# EAGLE design AquaLed-logic (EAGLE 8.4.1)
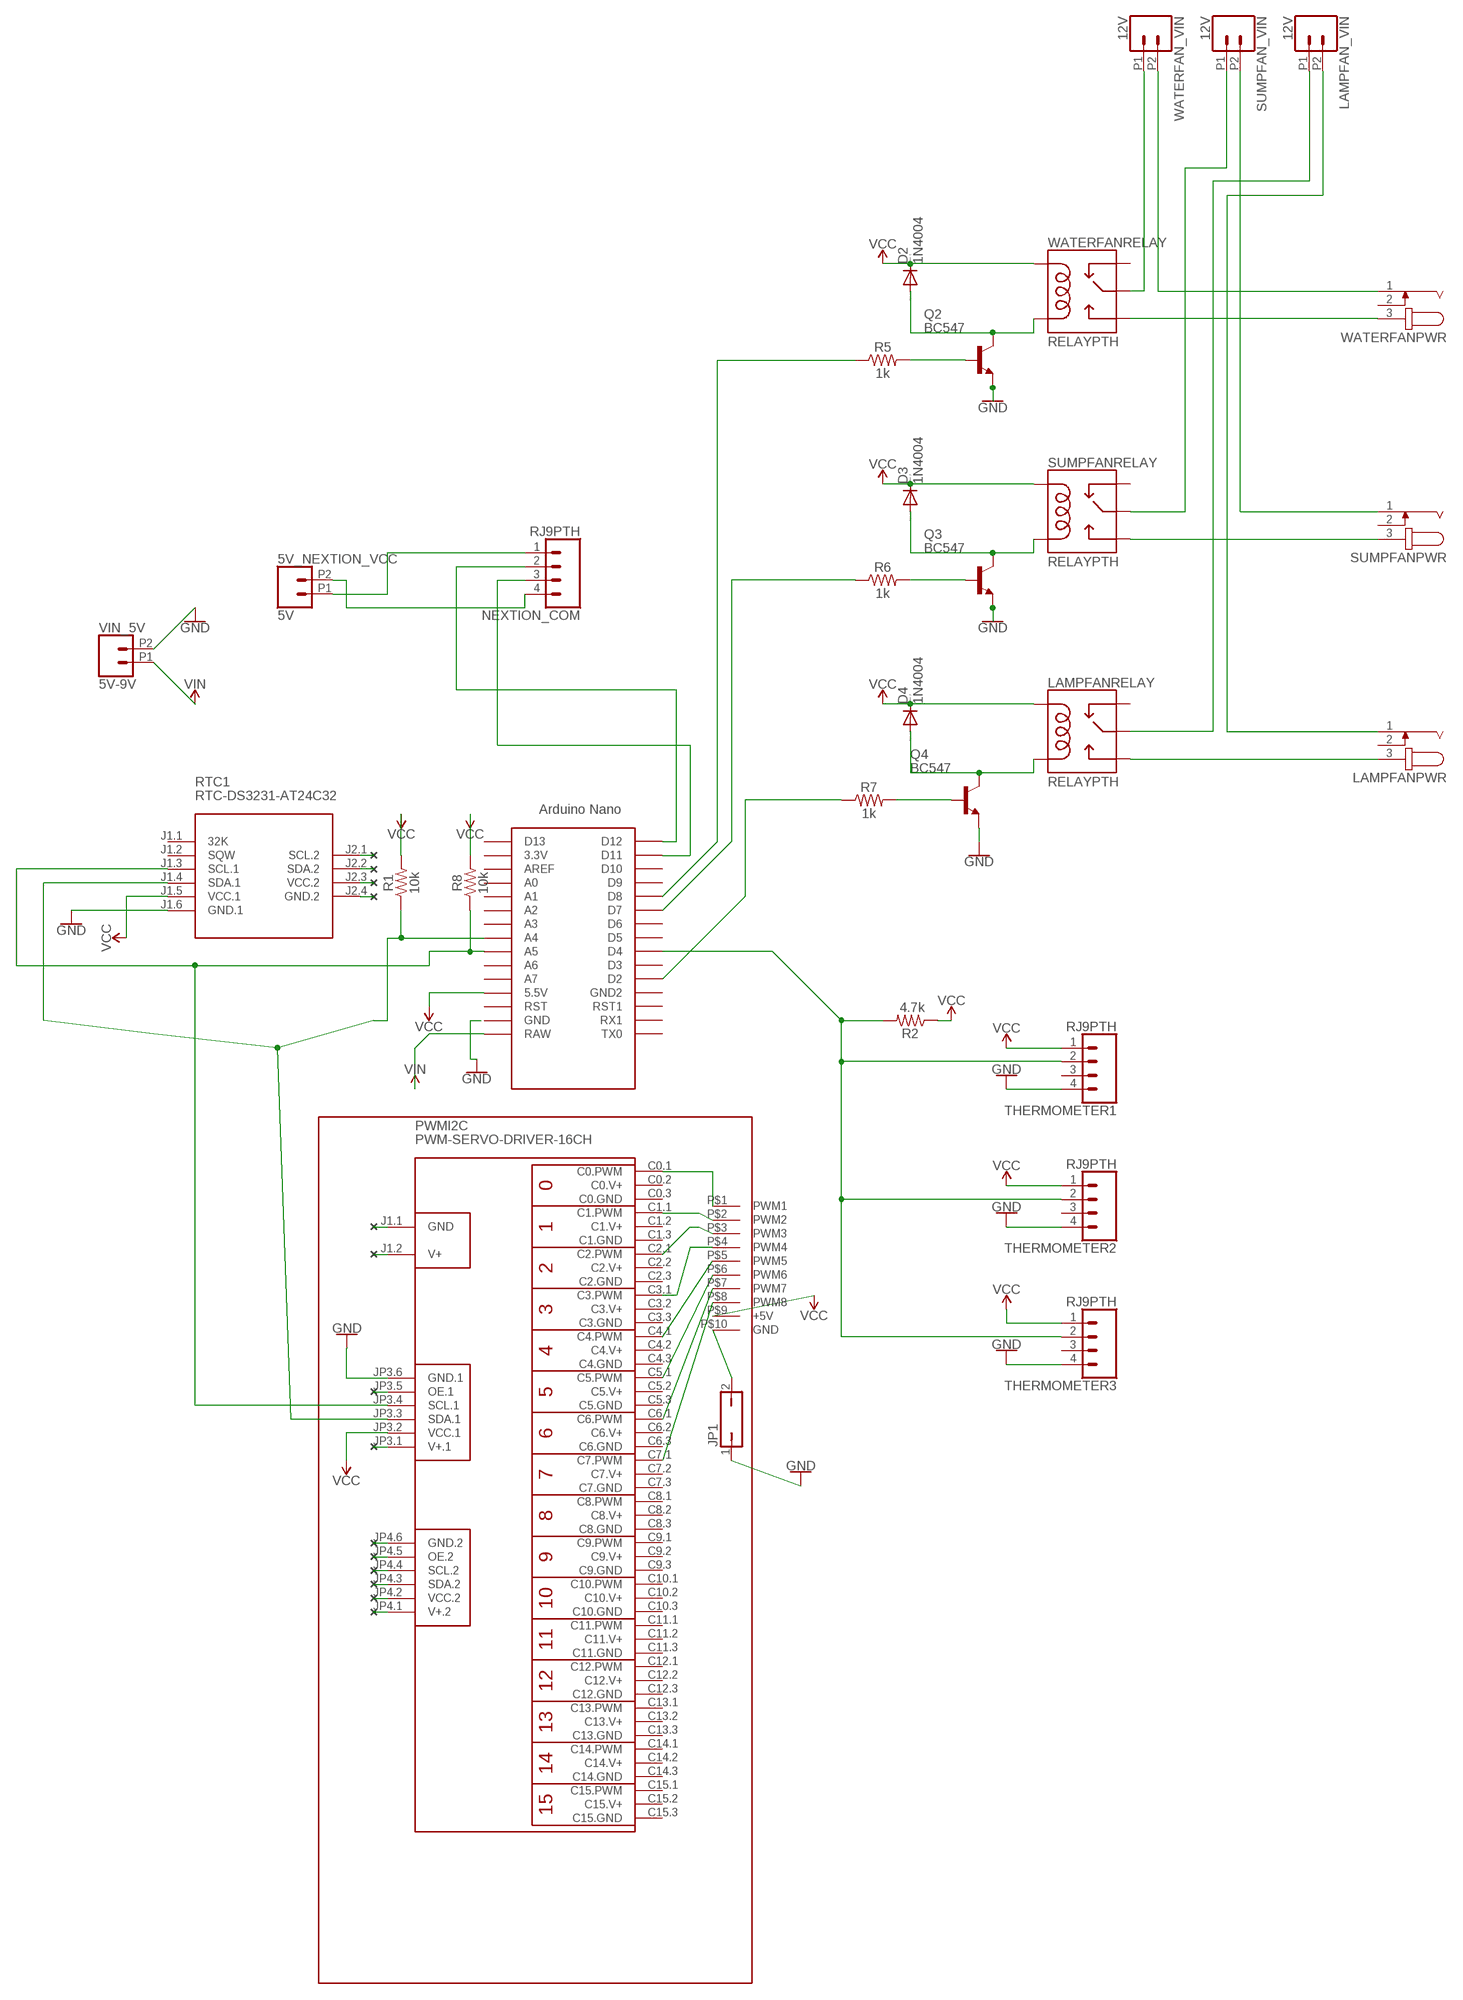
[diagram p0: schematic, sheet 1]

## Parts
5V_NEXTION_VCC  5V  CONN_022.54MM_SCREWTERM  [1X02_2.54_SCREWTERM]
D2  1N4004  [DO41-10]
D3  1N4004  [DO41-10]
D4  1N4004  [DO41-10]
JP1  JP1Q  [JP1]
LAMPFAN_VIN  12V  CONN_022.54MM_SCREWTERM  [1X02_2.54_SCREWTERM]
LAMPFANPWR  JACK-PLUG1  [SPC4078]
LAMPFANRELAY  RELAYPTH  [SRD-05VDC-SL-C]
NEXTION_COM  RJ9PTH  [RJ9]
PWMI2C  PWM-SERVO-DRIVER-16CH  [PWM-SERVO-DRIVER-16CH]
Q2  BC547  [TO92]
Q3  BC547  [TO92]
Q4  BC547  [TO92]
R1  10k  10KOHM-HORIZ-1/6W-5%  [AXIAL-0.3]
R2  4.7k  RESISTORAXIAL-0.3  [AXIAL-0.3]
R5  1k  10KOHM-HORIZ-1/4W-1%  [AXIAL-0.3]
R6  1k  10KOHM-HORIZ-1/4W-1%  [AXIAL-0.3]
R7  1k  10KOHM-HORIZ-1/4W-1%  [AXIAL-0.3]
R8  10k  10KOHM-HORIZ-1/6W-5%  [AXIAL-0.3]
RTC1  RTC-DS3231-AT24C32  [RTC-DS3231-AT24C32]
SUMPFAN_VIN  12V  CONN_022.54MM_SCREWTERM  [1X02_2.54_SCREWTERM]
SUMPFANPWR  JACK-PLUG1  [SPC4078]
SUMPFANRELAY  RELAYPTH  [SRD-05VDC-SL-C]
THERMOMETER1  RJ9PTH  [RJ9]
THERMOMETER2  RJ9PTH  [RJ9]
THERMOMETER3  RJ9PTH  [RJ9]
U$1  NANO  [NANO]
U$29  PCB  [PCB]
VIN_5V  5V-9V  CONN_022.54MM_SCREWTERM  [1X02_2.54_SCREWTERM]
WATERFAN_VIN  12V  CONN_022.54MM_SCREWTERM  [1X02_2.54_SCREWTERM]
WATERFANPWR  JACK-PLUG1  [SPC4078]
WATERFANRELAY  RELAYPTH  [SRD-05VDC-SL-C]

## Nets
GND [power]: JP1.1 PWMI2C.JP3.6(GND.1) Q2.1(E) Q3.1(E) Q4.1(E) RTC1.J1.6(GND.1) THERMOMETER1.4 THERMOMETER2.4 THERMOMETER3.4 U$1.GND VIN_5V.P2
N$1: R2.P$2 THERMOMETER1.2 THERMOMETER2.2 THERMOMETER3.2 U$1.D4
N$2: RTC1.J2.4(GND.2)
N$3: PWMI2C.JP3.3(SDA.1) R1.P$1 RTC1.J1.4(SDA.1) U$1.A4
N$4: R5.P$1 U$1.D8
N$5: R6.P$1 U$1.D7
N$6 [powerpwm]: LAMPFANPWR.3 LAMPFANRELAY.SWOPEN
N$7 [powerpwm]: SUMPFANPWR.3 SUMPFANRELAY.SWOPEN
N$8 [powerpwm]: LAMPFAN_VIN.P1 LAMPFANRELAY.SWCOMMON
N$9: R7.P$1 U$1.D2
N$10: D2.A Q2.3(C) WATERFANRELAY.COIL0
N$11: Q2.2(B) R5.P$2
N$12 [powerpwm]: SUMPFAN_VIN.P2 SUMPFANPWR.1
N$13: D3.A Q3.3(C) SUMPFANRELAY.COIL0
N$14: Q3.2(B) R6.P$2
N$15 [powerpwm]: LAMPFAN_VIN.P2 LAMPFANPWR.1
N$16: D4.A LAMPFANRELAY.COIL0 Q4.3(C)
N$17: Q4.2(B) R7.P$2
N$18 [powerpwm]: SUMPFAN_VIN.P1 SUMPFANRELAY.SWCOMMON
N$19 [powerpwm]: WATERFAN_VIN.P1 WATERFANRELAY.SWCOMMON
N$20 [powerpwm]: WATERFAN_VIN.P2 WATERFANPWR.1
N$21 [powerpwm]: WATERFANPWR.3 WATERFANRELAY.SWOPEN
N$22: 5V_NEXTION_VCC.P1 NEXTION_COM.1
N$23: 5V_NEXTION_VCC.P2 NEXTION_COM.4
N$24: NEXTION_COM.3 U$1.D11
N$25: NEXTION_COM.2 U$1.D12
N$26 [power]: PWMI2C.JP3.4(SCL.1) R8.P$1 RTC1.J1.3(SCL.1) U$1.A5
N$27: RTC1.J2.3(VCC.2)
N$28: PWMI2C.C0.1(C0.PWM) U$29.P$1(PWM1)
N$29: PWMI2C.C1.1(C1.PWM) U$29.P$2(PWM2)
N$30: PWMI2C.C2.1(C2.PWM) U$29.P$3(PWM3)
N$31: PWMI2C.C3.1(C3.PWM) U$29.P$4(PWM4)
N$32: PWMI2C.C4.1(C4.PWM) U$29.P$5(PWM5)
N$33: PWMI2C.C5.1(C5.PWM) U$29.P$6(PWM6)
N$34: PWMI2C.C6.1(C6.PWM) U$29.P$7(PWM7)
N$35: PWMI2C.C7.1(C7.PWM) U$29.P$8(PWM8)
N$36: JP1.2 U$29.P$10(GND)
N$54: RTC1.J2.2(SDA.2)
N$55: RTC1.J2.1(SCL.2)
N$56: PWMI2C.JP4.6(GND.2)
N$57: PWMI2C.JP4.5(OE.2)
N$58: PWMI2C.JP4.4(SCL.2)
N$59: PWMI2C.JP4.3(SDA.2)
N$60: PWMI2C.JP4.2(VCC.2)
N$61: PWMI2C.JP4.1(V+.2)
N$62: PWMI2C.JP3.1(V+.1)
N$63: PWMI2C.JP3.5(OE.1)
N$64: PWMI2C.J1.1(GND)
N$65: PWMI2C.J1.2(V+)
VCC [power]: D2.C D3.C D4.C LAMPFANRELAY.COIL1 PWMI2C.JP3.2(VCC.1) R1.P$2 R2.P$1 R8.P$2 RTC1.J1.5(VCC.1) SUMPFANRELAY.COIL1 THERMOMETER1.1 THERMOMETER2.1 THERMOMETER3.1 U$1.5V(5.5V) U$29.P$9(+5V) WATERFANRELAY.COIL1
VIN [power]: U$1.RAW VIN_5V.P1
Unconnected: LAMPFANPWR.2 LAMPFANRELAY.SWCLOSED(SWCLOSE) PWMI2C.C0.2(C0.V+) PWMI2C.C0.3(C0.GND) PWMI2C.C1.2(C1.V+) PWMI2C.C1.3(C1.GND) PWMI2C.C2.2(C2.V+) PWMI2C.C2.3(C2.GND) PWMI2C.C3.2(C3.V+) PWMI2C.C3.3(C3.GND) PWMI2C.C4.2(C4.V+) PWMI2C.C4.3(C4.GND) PWMI2C.C5.2(C5.V+) PWMI2C.C5.3(C5.GND) PWMI2C.C6.2(C6.V+) PWMI2C.C6.3(C6.GND) PWMI2C.C7.2(C7.V+) PWMI2C.C7.3(C7.GND) PWMI2C.C8.1(C8.PWM) PWMI2C.C8.2(C8.V+) PWMI2C.C8.3(C8.GND) PWMI2C.C9.1(C9.PWM) PWMI2C.C9.2(C9.V+) PWMI2C.C9.3(C9.GND) PWMI2C.C10.1(C10.PWM) PWMI2C.C10.2(C10.V+) PWMI2C.C10.3(C10.GND) PWMI2C.C11.1(C11.PWM) PWMI2C.C11.2(C11.V+) PWMI2C.C11.3(C11.GND) PWMI2C.C12.1(C12.PWM) PWMI2C.C12.2(C12.V+) PWMI2C.C12.3(C12.GND) PWMI2C.C13.1(C13.PWM) PWMI2C.C13.2(C13.V+) PWMI2C.C13.3(C13.GND) PWMI2C.C14.1(C14.PWM) PWMI2C.C14.2(C14.V+) PWMI2C.C14.3(C14.GND) PWMI2C.C15.1(C15.PWM) PWMI2C.C15.2(C15.V+) PWMI2C.C15.3(C15.GND) RTC1.J1.1(32K) RTC1.J1.2(SQW) SUMPFANPWR.2 SUMPFANRELAY.SWCLOSED(SWCLOSE) THERMOMETER1.3 THERMOMETER2.3 THERMOMETER3.3 U$1.3.3V U$1.A0 U$1.A1 U$1.A2 U$1.A3 U$1.A6 U$1.A7 U$1.AREF U$1.D3 U$1.D5 U$1.D6 U$1.D9 U$1.D10 U$1.D13 U$1.GND1(GND2) U$1.ICSP1 U$1.ICSP2 U$1.ICSP3 U$1.ICSP4 U$1.ICSP5 U$1.ICSP6 U$1.RST U$1.RST1 U$1.RX1 U$1.TX0 WATERFANPWR.2 WATERFANRELAY.SWCLOSED(SWCLOSE)

## Library data of the parts
5V_NEXTION_VCC LAMPFAN_VIN SUMPFAN_VIN VIN_5V WATERFAN_VIN = SparkFun-Connectors:CONN_02: Multi connection point. Often used as Generic Header-pin footprint for 0.1 inch spaced/style header connections On any of the 0.1 inch spaced packages, you can populate with these: Break Away Headers - Straight <https://www.sparkfun.com/products/116> (PRT-00116) Break Away Male Headers - Right Angle <https://www.sparkfun.com/products/553> (PRT-00553) Female Headers <https://www.sparkfun.com/products/115> (PRT-00115) Break Away Headers - Machine Pin <https://www.sparkfun.com/products/117> (PRT-00117) Break Away Female Headers - Swiss Machine Pin <https://www.sparkfun.com/products/743> (PRT-00743) For SCREWTERMINALS and SPRING TERMINALS visit here: Screw Terimnals on SparkFun.com <https://www.sparkfun.com/search/results?term=Screw+Terminals> (5mm/3.5mm/2.54mm spacing) This device is also useful as a general connection point to wire up your design to another part of your project. Our various solder wires solder well into these plated through hole pads. Hook-Up Wire - Assortment (Stranded, 22 AWG) <https://www.sparkfun.com/products/11375> (PRT-11375) Hook-Up Wire - Assortment (Solid Core, 22 AWG) <https://www.sparkfun.com/products/11367> (PRT-11367) View the entire wire category on our website here <https://www.sparkfun.com/categories/141> Special notes: Molex polarized connector foot print use with: PRT-08233 with associated crimp pins and housings. 2.54_SCREWTERM for use with PRT-10571. 3.5mm Screw Terminal footprints for PRT-08084 5mm Screw Terminal footprints for use with PRT-08432
D2-D4 = diode:1N4004: DIODE general purpose rectifier, 1 A
JP1 = jumper:JP1Q: JUMPER
LAMPFANPWR SUMPFANPWR WATERFANPWR = con-jack:JACK-PLUG: DC POWER JACK Power Jack, DC, Right Angle, Through Hole, Rated 5A at 16VDC, PC Terminals Distributor: Farnell (www.Farnell.de) Drawing: 84N1161.pdf / 84N1162.pdf Manufacturer: SPC Technology (www.spctechnology.com) Type: SPC4077 / SPC 4078
LAMPFANRELAY SUMPFANRELAY WATERFANRELAY = SRD-05VDC-SL-C:RELAY: SPDT relay (COM-00101)
NEXTION_COM THERMOMETER1-THERMOMETER3 = SparkFun-Retired:RJ9: This is a 4-pin connector commonly found on phone handsets. Great for simple TX/RX/PWR/GND connections. Sometime referred to as RJ9 or 4P4C. SparkFun does not currently use this on any active designs, and the connector alone has been retired. However, for more info visit here: https://www.sparkfun.com/products/retired/8694
PWMI2C = diy-modules:PWM-SERVO-DRIVER-16CH: 16-Channel 12-bit PWM/Servo Driver based on PCA9685 chip PCA9685 datasheet is available here: http://www.nxp.com/documents/data_sheet/PCA9685.pdf Arduino Library for PCA9685 is available here: https://github.com/kasperskaarhoj/PCA9685-Arduino-Library Click here to find device on ebay.com <http://www.ebay.com/sch/pwm+servo+module+pca9685>
Q2-Q4 = transistor-npn:BC547*: NPN Transistor
R1 R8 = SparkFun-Resistors:10KOHM: 10kΩ resistor A resistor is a passive two-terminal electrical component that implements electrical resistance as a circuit element. Resistors act to reduce current flow, and, at the same time, act to lower voltage levels within circuits. - Wikipedia; PROD_ID: RES-08375
R2 = SparkFun-Resistors:RESISTOR: Generic Resistor Package
R5-R7 = SparkFun-Resistors:10KOHM: 10kΩ resistor A resistor is a passive two-terminal electrical component that implements electrical resistance as a circuit element. Resistors act to reduce current flow, and, at the same time, act to lower voltage levels within circuits. - Wikipedia; PROD_ID: RES-12183; VALUE: 10k
RTC1 = diy-modules:RTC-DS3231-AT24C32: RTC Module with Battery and EEPROM based on DS3231 and AT24C32 chips Tutorial can be found here: https://edwardmallon.wordpress.com/2014/05/21/using-a-cheap-3-ds3231-rtc-at24c32-eeprom-from-ebay/ Click here to find device on ebay.com <http://www.ebay.com/sch/DS3231+AT24C32+module>; SPICEPREFIX: X
U$1 = Arduino-clone:NANO: Arduino Nano
U$29 = aqualed:PCB

## Net classes
0 default: width 0.406 mm
1 powerin: width 2 mm, clearance 0.6 mm
2 powerpwm: width 0.635 mm, clearance 0.5 mm
3 power: width 0.5 mm, clearance 0.2 mm

## Board
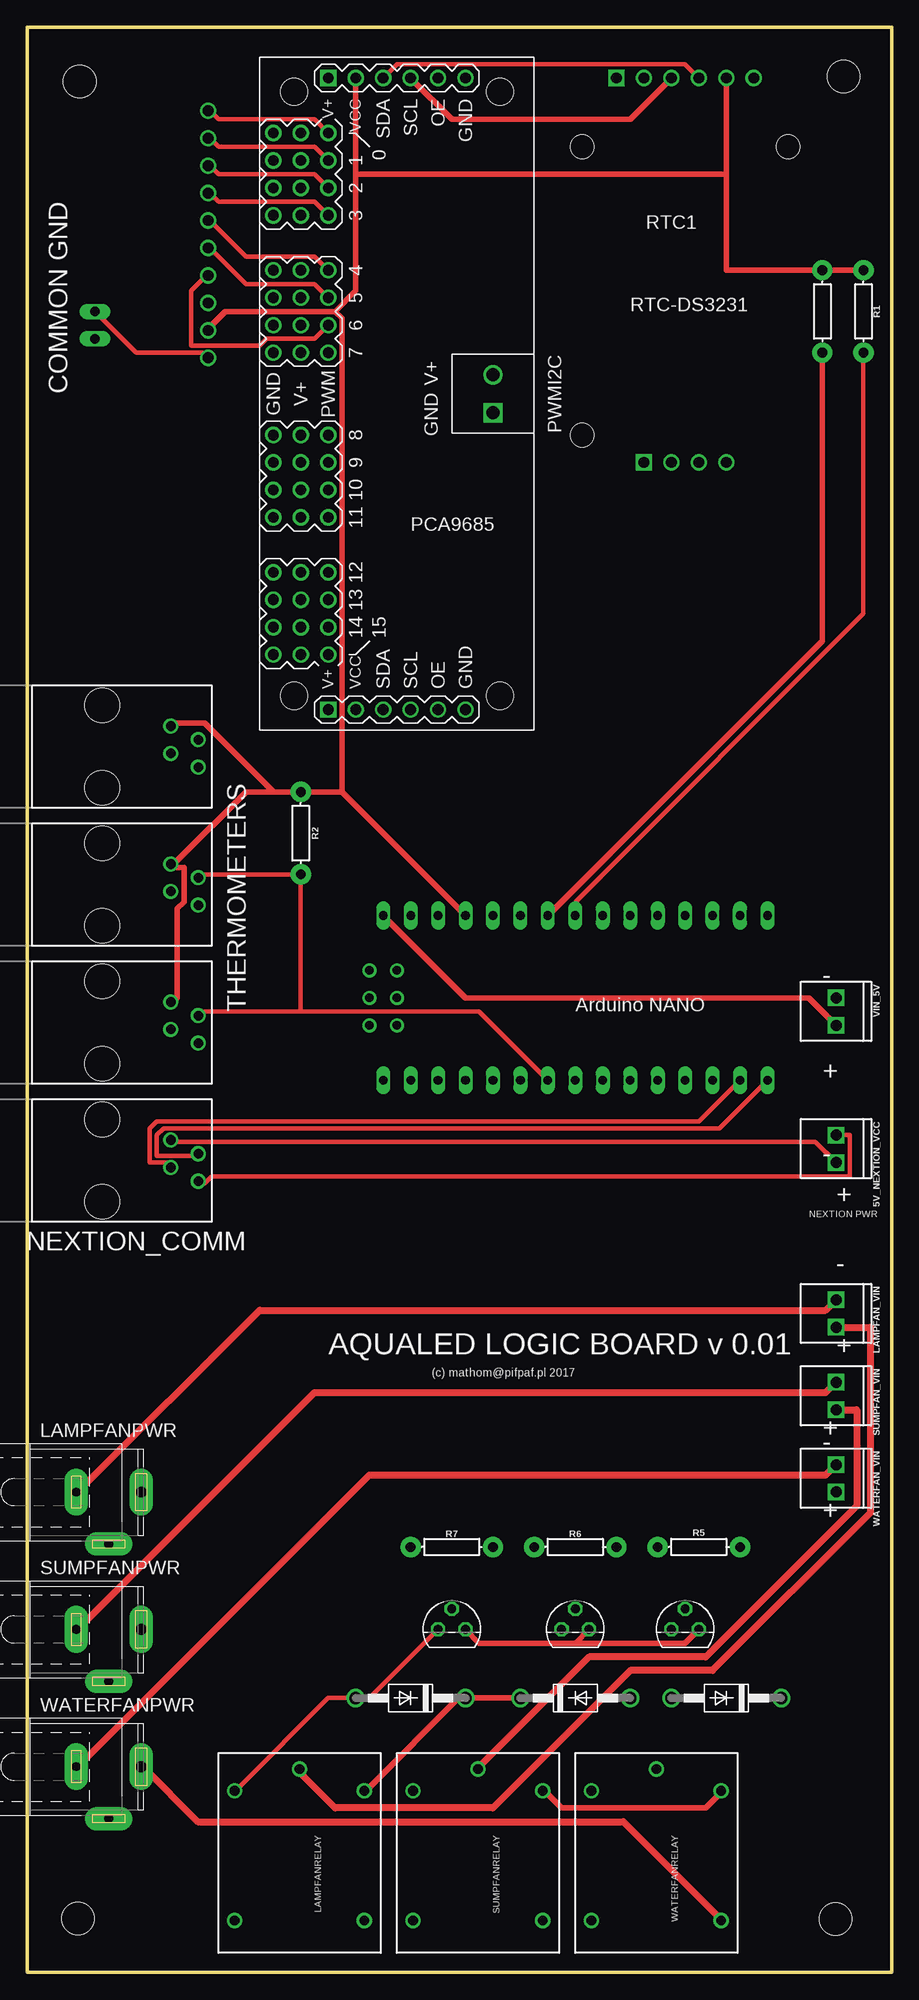
[diagram p1: board, top side]
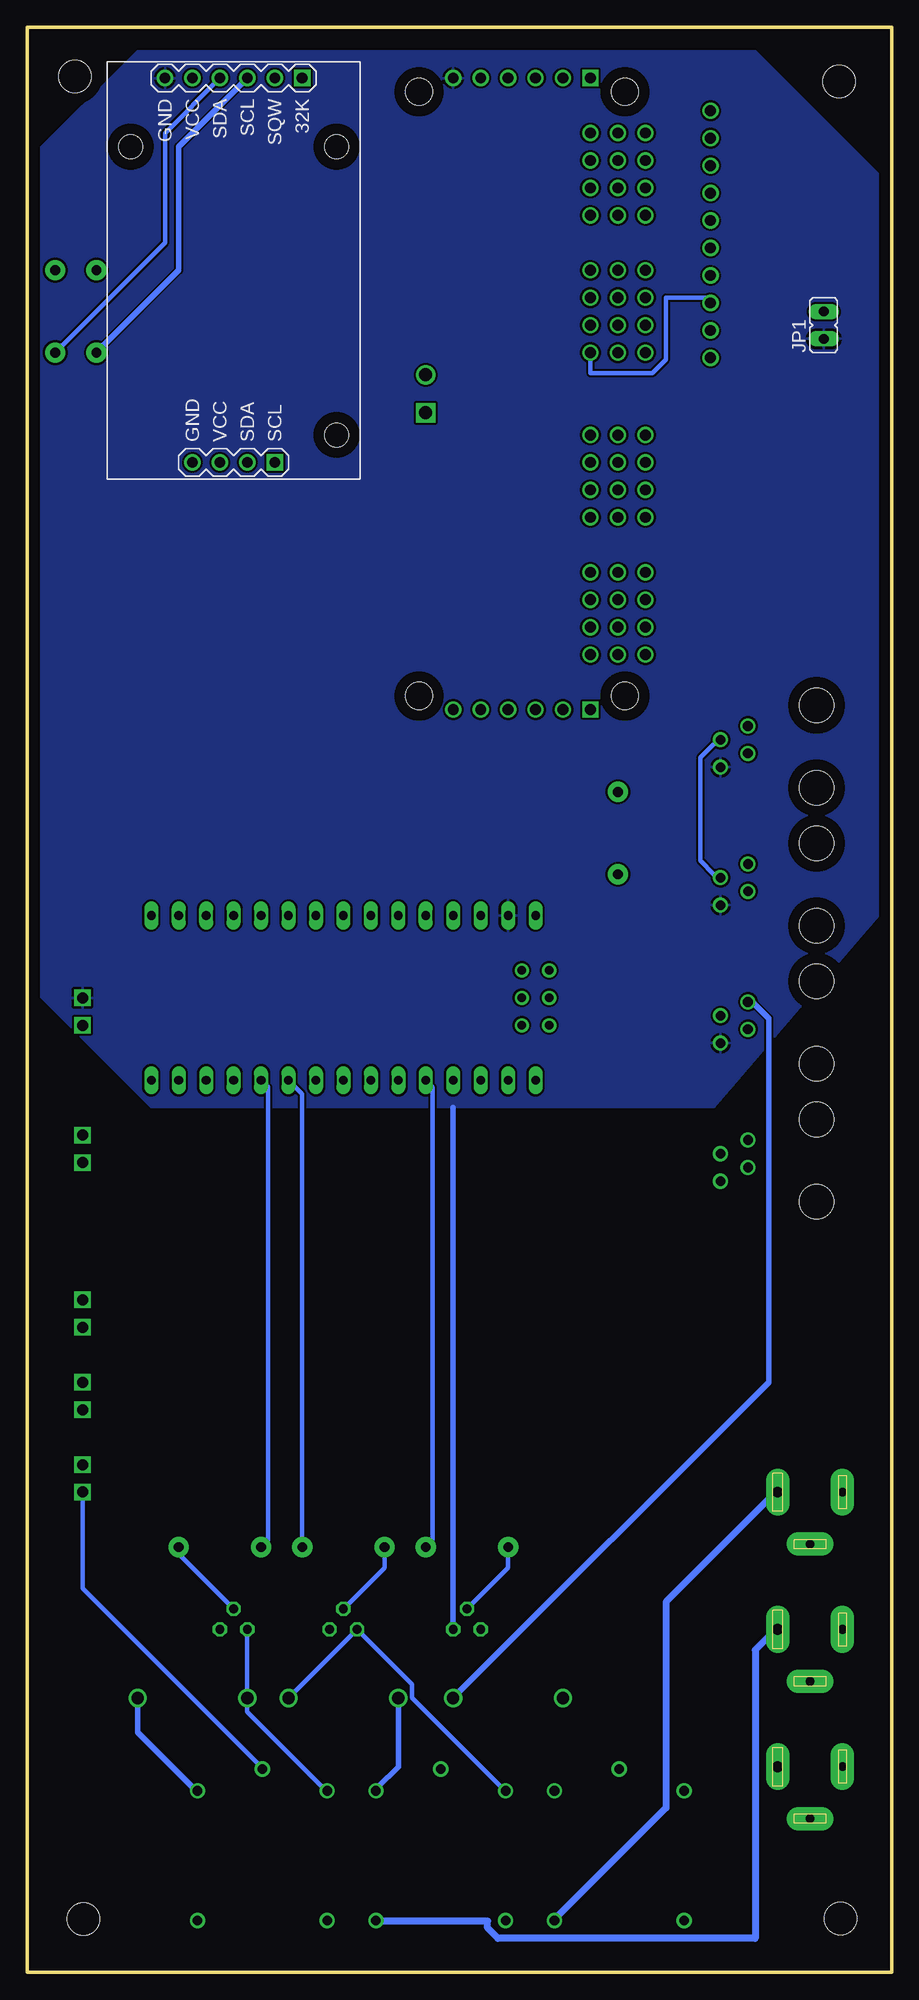
[diagram p2: board, bottom side, seen from below]

Size 80.01 x 179.97 mm. Coordinates in mm from the lower left corner, seen from the top.
Outline: 0,179.97 80.01,179.97 80.01,0 0,0 0,179.97
Copper layers (1*16): Top 0.035mm / dielectric 1.5mm / Bottom 0.035mm
Design rules "default": minimum track width 6mil, minimum drill 0.35mm, track to track 6mil, track to pad 6mil, pad to pad 6mil, via to via 6mil, smd to smd 6mil, copper to edge 40mil, drill to drill 6mil, minimum pad ring 10mil, minimum via ring 8mil, stop-mask expansion 4mil, vias tented up to drill 0mil, thermal gap 10mil

### Footprints (pad centres in the part's own frame; a part is rotated, then mirrored left to right if it is on the bottom)
1X02_2.54_SCREWTERM = drill 1.016 square: P1 2.54,0; P2 0,0
DO41-10 = drill 1.118: A 5.08,0; C -5.08,0
JP1 = drill 0.914 long: 1 0,-1.27; 2 0,1.27
SPC4078 = drill 0.8 pad 2.184 long: 1 -3,0; 2 0,-4.8 | drill 1 pad 2.184 long: 3 3,0
SRD-05VDC-SL-C = drill 0.9: COIL0 -5.39,-6.12; COIL1 -5.39,5.88; SWCLOSED 6.61,-6.12; SWCOMMON -7.39,-0.12; SWOPEN 6.61,5.88
RJ9 = drill 0.889: 1 -1.905,6.35; 2 -0.635,8.89; 3 0.635,6.35; 4 1.905,8.89 | hole 3.2: -3.81,0; 3.81,0
PWM-SERVO-DRIVER-16CH = drill 1: C0.1 -24.13,-6.35; C0.2 -24.13,-8.89; C0.3 -24.13,-11.43; C1.1 -21.59,-6.35; C1.2 -21.59,-8.89; C1.3 -21.59,-11.43; C2.1 -19.05,-6.35; C2.2 -19.05,-8.89; C2.3 -19.05,-11.43; C3.1 -16.51,-6.35; C3.2 -16.51,-8.89; C3.3 -16.51,-11.43; C4.1 -11.43,-6.35; C4.2 -11.43,-8.89; C4.3 -11.43,-11.43; C5.1 -8.89,-6.35; C5.2 -8.89,-8.89; C5.3 -8.89,-11.43; C6.1 -6.35,-6.35; C6.2 -6.35,-8.89; C6.3 -6.35,-11.43; C7.1 -3.81,-6.35; C7.2 -3.81,-8.89; C7.3 -3.81,-11.43; C8.1 3.81,-6.35; C8.2 3.81,-8.89; C8.3 3.81,-11.43; C9.1 6.35,-6.35; C9.2 6.35,-8.89; C9.3 6.35,-11.43; C10.1 8.89,-6.35; C10.2 8.89,-8.89; C10.3 8.89,-11.43; C11.1 11.43,-6.35; C11.2 11.43,-8.89; C11.3 11.43,-11.43; C12.1 16.51,-6.35; C12.2 16.51,-8.89; C12.3 16.51,-11.43; C13.1 19.05,-6.35; C13.2 19.05,-8.89; C13.3 19.05,-11.43; C14.1 21.59,-6.35; C14.2 21.59,-8.89; C14.3 21.59,-11.43; C15.1 24.13,-6.35; C15.2 24.13,-8.89; C15.3 24.13,-11.43; JP3.2 -29.21,-3.81; JP3.3 -29.21,-1.27; JP3.4 -29.21,1.27; JP3.5 -29.21,3.81; JP3.6 -29.21,6.35; JP4.2 29.21,-3.81; JP4.3 29.21,-1.27; JP4.4 29.21,1.27; JP4.5 29.21,3.81; JP4.6 29.21,6.35 | drill 1.2 square: J1.1 1.753,8.89 | drill 1.2: J1.2 -1.753,8.89 | drill 1 square: JP3.1 -29.21,-6.35; JP4.1 29.21,-6.35 | hole 2.5: -27.94,9.525; -27.94,-9.525; 27.94,9.525; 27.94,-9.525
TO92 = drill 0.813 octagon: 1 1.27,0; 2 0,1.905; 3 -1.27,0
AXIAL-0.3 = drill 0.9 pad 1.88: P$1 -3.81,0; P$2 3.81,0
RTC-DS3231-AT24C32 = drill 1 square: J1.1 -17.78,6.35; J2.1 17.78,3.81 | drill 1: J1.2 -17.78,3.81; J1.3 -17.78,1.27; J1.4 -17.78,-1.27; J1.5 -17.78,-3.81; J1.6 -17.78,-6.35; J2.2 17.78,1.27; J2.3 17.78,-1.27; J2.4 17.78,-3.81 | hole 2.2: -11.43,-9.525; -11.43,9.525; 15.24,9.525
NANO = drill 0.8 long: 3.3V -10.16,24.13; 5V -10.16,-1.27; A0 -10.16,19.05; A1 -10.16,16.51; A2 -10.16,13.97; A3 -10.16,11.43; A4 -10.16,8.89; A5 -10.16,6.35; A6 -10.16,3.81; A7 -10.16,1.27; AREF -10.16,21.59; D2 5.08,1.27; D3 5.08,3.81; D4 5.08,6.35; D5 5.08,8.89; D6 5.08,11.43; D7 5.08,13.97; D8 5.08,16.51; D9 5.08,19.05; D10 5.08,21.59; D11 5.08,24.13; D12 5.08,26.67; D13 -10.16,26.67; GND -10.16,-6.35; GND1 5.08,-1.27; RAW -10.16,-8.89; RST -10.16,-3.81; RST1 5.08,-3.81; RX1 5.08,-6.35; TX0 5.08,-8.89 | drill 0.8: ICSP1 -5.08,-10.16; ICSP2 -5.08,-7.62; ICSP3 -2.54,-10.16; ICSP4 -2.54,-7.62; ICSP5 0,-10.16; ICSP6 0,-7.62
PCB = drill 1: P$1 16.83,172.24; P$2 16.83,169.7; P$3 16.83,167.16; P$4 16.83,164.62; P$5 16.83,162.08; P$6 16.83,159.54; P$7 16.83,157; P$8 16.83,154.46; P$9 16.83,151.92; P$10 16.83,149.38 | hole 3: 4.94,174.96; 75.64,175.39; 74.86,4.97; 4.79,5.02

### Placement (x,y rotation side)
5V_NEXTION_VCC  74.87,77.46 270 top
D2  64.71,25.39 180 top
D3  50.74,25.39 0 top
D4  35.5,25.39 180 top
JP1  6.29,152.39 0 bottom
LAMPFAN_VIN  74.87,62.22 270 top
LAMPFANPWR  7.56,44.44 0 top
LAMPFANRELAY  25.34,11.42 270 top
NEXTION_COM  6.95,75.11 270 top
PWMI2C  34.23,146.04 270 top
Q2  60.9,31.74 0 top
Q3  50.74,31.74 0 top
Q4  39.31,31.74 0 top
R1  77.41,153.66 90 top
R2  25.34,105.4 270 top
R5  62.17,39.36 0 top
R6  50.74,39.36 180 top
R7  39.31,39.36 180 top
R8  73.6,153.66 90 top
RTC1  60.9,157.47 270 bottom
SUMPFAN_VIN  74.87,54.6 270 top
SUMPFANPWR  7.56,31.74 0 top
SUMPFANRELAY  41.85,11.42 270 top
THERMOMETER1  6.96,113.4 270 top
THERMOMETER2  6.96,87.87 270 top
THERMOMETER3  6.95,100.64 270 top
U$1  41.85,87.62 270 top
U$29  -0.06,-0.01 0 top
VIN_5V  74.87,90.16 270 top
WATERFAN_VIN  74.87,46.98 270 top
WATERFANPWR  7.56,19.04 0 top
WATERFANRELAY  58.36,11.42 270 top

### Tracks (layer width: path | path; a pad name or v marks a point on that pad's centre or on a via)
GND
  Top 0.5: Q4.1 41.85,30.47 50.74,30.47 | Q3.1 50.74,30.47 | Q2.1 60.9,30.47 50.74,30.47
  Bottom 0.5: 40.58,80 Q4.1
  pour Bottom: 1.21,166.36 12.64,177.79 69.79,177.79 79.95,167.63 79.95,91.43 68.52,80 16.45,80 1.21,97.78
N$1
  Top 0.406: THERMOMETER3.2 16.45,101.59 R2.P$2 25.34,88.89 | U$1.D4 41.85,88.89 25.34,88.89 | 25.34,88.89 16.45,88.89 THERMOMETER2.2
  Bottom 0.406: THERMOMETER1.2 16.45,113.65 17.72,112.38 17.72,102.86 16.45,101.59 THERMOMETER3.2
N$3
  Top 0.406: PWMI2C.JP3.3 34.23,176.52 60.9,176.52 RTC1.J1.4 | U$1.A4 50.74,99.05 77.41,125.72 R1.P$1
  Bottom 0.406: RTC1.J1.4 67.25,170.17 67.25,160.01 76.77,150.48 77.41,150.48 R1.P$1
N$4
  Bottom 0.406: U$1.D8 57.72,81.9 57.72,39.99 R5.P$1
N$5
  Bottom 0.406: U$1.D7 54.55,81.27 R6.P$1
N$6
  Bottom 0.635: LAMPFANRELAY.SWOPEN 31.05,5.07 20.89,15.23 20.89,34.28 10.73,44.44 LAMPFANPWR.3
N$7
  Bottom 0.635: SUMPFANRELAY.SWOPEN 47.56,4.75 37.4,4.75 37.4,4.12 36.45,3.16 12.64,3.16 12.64,29.83 10.73,31.74 SUMPFANPWR.3
N$8
  Top 0.635: LAMPFAN_VIN.P1 78.04,59.68 78.04,42.53 63.44,27.93 55.82,27.93 43.12,15.23 28.51,15.23 25.34,18.4 LAMPFANRELAY.SWCOMMON
N$9
  Bottom 0.406: U$1.D2 42.48,81.9 42.48,39.99 R7.P$1
N$10
  Bottom 0.406: Q2.3 D2.A 59.63,24.12 52.64,17.13 WATERFANRELAY.COIL0
N$11
  Bottom 0.406: Q2.2 65.98,38.72 R5.P$2
N$12
  Top 0.635: SUMPFAN_VIN.P2 73.91,53.64 26.61,53.64 4.7,31.74 SUMPFANPWR.1
N$13
  Bottom 0.406: D3.A Q3.3 44.39,26.66 44.39,25.39 36.13,17.13 SUMPFANRELAY.COIL0
N$14
  Bottom 0.406: Q3.2 46.93,37.45 R6.P$2
N$15
  Top 0.635: LAMPFAN_VIN.P2 73.91,61.27 21.53,61.27 4.7,44.44 LAMPFANPWR.1
N$16
  Top 0.406: Q4.3 31.69,25.39 D4.A 27.88,25.39 19.62,17.13 LAMPFANRELAY.COIL0
N$17
  Bottom 0.406: Q4.2 35.5,37.45 R7.P$2
N$18
  Top 0.635: SUMPFAN_VIN.P1 76.77,52.06 76.77,43.17 62.8,29.2 52.01,29.2 41.85,19.04 SUMPFANRELAY.SWCOMMON
N$19
  Bottom 0.406: WATERFAN_VIN.P1 74.87,35.55 58.36,19.04 WATERFANRELAY.SWCOMMON
N$20
  Top 0.635: WATERFAN_VIN.P2 73.91,46.03 31.69,46.03 4.7,19.04 WATERFANPWR.1
N$21
  Top 0.635: WATERFANRELAY.SWOPEN 64.07,5.07 55.18,13.96 15.81,13.96 10.73,19.04 WATERFANPWR.3
N$22
  Top 0.406: 5V_NEXTION_VCC.P1 72.96,76.82 13.91,76.82 NEXTION_COM.1
N$23
  Top 0.406: 5V_NEXTION_VCC.P2 76.14,77.46 76.14,73.65 17.08,73.65 16.45,73.01 NEXTION_COM.4
N$24
  Top 0.406: U$1.D11 62.17,78.73 12,78.73 11.37,78.09 11.37,74.92 13.27,74.92 NEXTION_COM.3
N$25
  Top 0.406: U$1.D12 64.07,78.09 12.64,78.09 12,77.46 12,75.55 15.81,75.55 NEXTION_COM.2
N$26
  Top 0.5: PWMI2C.JP3.4 39.31,171.44 55.82,171.44 RTC1.J1.3 | U$1.A5 73.6,123.18 R8.P$1
  Bottom 0.5: RTC1.J1.3 65.98,168.9 65.98,157.47 72.96,150.48 73.6,150.48 R8.P$1
N$28
  Top 0.406: PWMI2C.C0.1 26.61,171.44 17.72,171.44 17.08,172.07 U$29.P$1
N$29
  Top 0.406: PWMI2C.C1.1 26.61,168.9 17.72,168.9 17.08,169.53 U$29.P$2
N$30
  Top 0.406: PWMI2C.C2.1 26.61,166.36 17.72,166.36 17.08,166.99 U$29.P$3
N$31
  Top 0.406: PWMI2C.C3.1 26.61,163.82 17.72,163.82 17.08,164.45 U$29.P$4
N$32
  Top 0.406: PWMI2C.C4.1 26.61,158.74 20.26,158.74 17.08,161.91 U$29.P$5
N$33
  Top 0.406: PWMI2C.C5.1 26.61,156.2 20.26,156.2 17.08,159.37 U$29.P$6
N$34
  Top 0.406: PWMI2C.C6.1 26.61,151.12 22.16,151.12 21.53,150.48 15.18,150.48 15.18,155.56 16.45,156.83 U$29.P$7
N$35
  Bottom 0.406: PWMI2C.C7.1 27.88,147.94 22.16,147.94 20.89,149.21 20.89,154.93 17.08,154.93 U$29.P$8
N$36
  Top 0.406: JP1.2 10.1,149.85 16.45,149.85 U$29.P$10
VCC
  Top 0.5: 64.71,166.36 64.71,157.47 R8.P$2 R1.P$2 | 64.71,166.36 RTC1.J1.5 | 28.51,153.66 18.35,153.66 17.08,152.39 U$29.P$9 | 28.51,153.66 30.42,155.56 30.42,166.36 | PWMI2C.JP3.2 30.42,166.36 | 30.42,166.36 64.71,166.36 | LAMPFANRELAY.COIL1 31.69,17.13 39.94,25.39 D4.C D3.C | WATERFANRELAY.COIL1 64.07,16.5 62.8,15.23 49.47,15.23 48.2,16.5 SUMPFANRELAY.COIL1 | 29.15,109.21 U$1.5V | 29.15,109.21 R2.P$1 22.8,109.21 | 22.8,109.21 20.26,109.21 13.91,102.86 THERMOMETER3.1 13.91,102.22 14.54,102.22 14.54,99.05 13.91,98.41 13.91,90.16 THERMOMETER2.1 | 22.8,109.21 16.45,115.56 13.91,115.56 THERMOMETER1.1 | 28.51,153.66 29.15,153.02 29.15,109.21
  Bottom 0.5: D2.C 69.79,22.21 64.71,17.13 WATERFANRELAY.COIL1 | D3.C 45.66,19.04 47.56,17.13 SUMPFANRELAY.COIL1 | D4.C 11.37,54.6 11.37,88.25 13.27,90.16 THERMOMETER2.1
VIN
  Top 0.5: U$1.RAW 40.58,90.16 72.33,90.16 VIN_5V.P1

### Text on the board
tPlace: RTC-DS3231 | COMMON GND | PCA9685 | - | THERMOMETERS | Arduino NANO | + | - | + | NEXTION PWR | NEXTION_COMM | - | AQUALED LOGIC BOARD v 0.01 | + | (c) mathom@pifpaf.pl 2017 | + | - | +